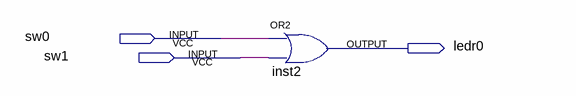
[diagram p0: schematic sheet]
// Quartus schematic or2in.bdf as structural Verilog: 1 symbols, 3 pins
module or2in (
  input  sw0,
  input  sw1,
  output ledr0
);

  or inst2 (ledr0, sw0, sw1);
endmodule
